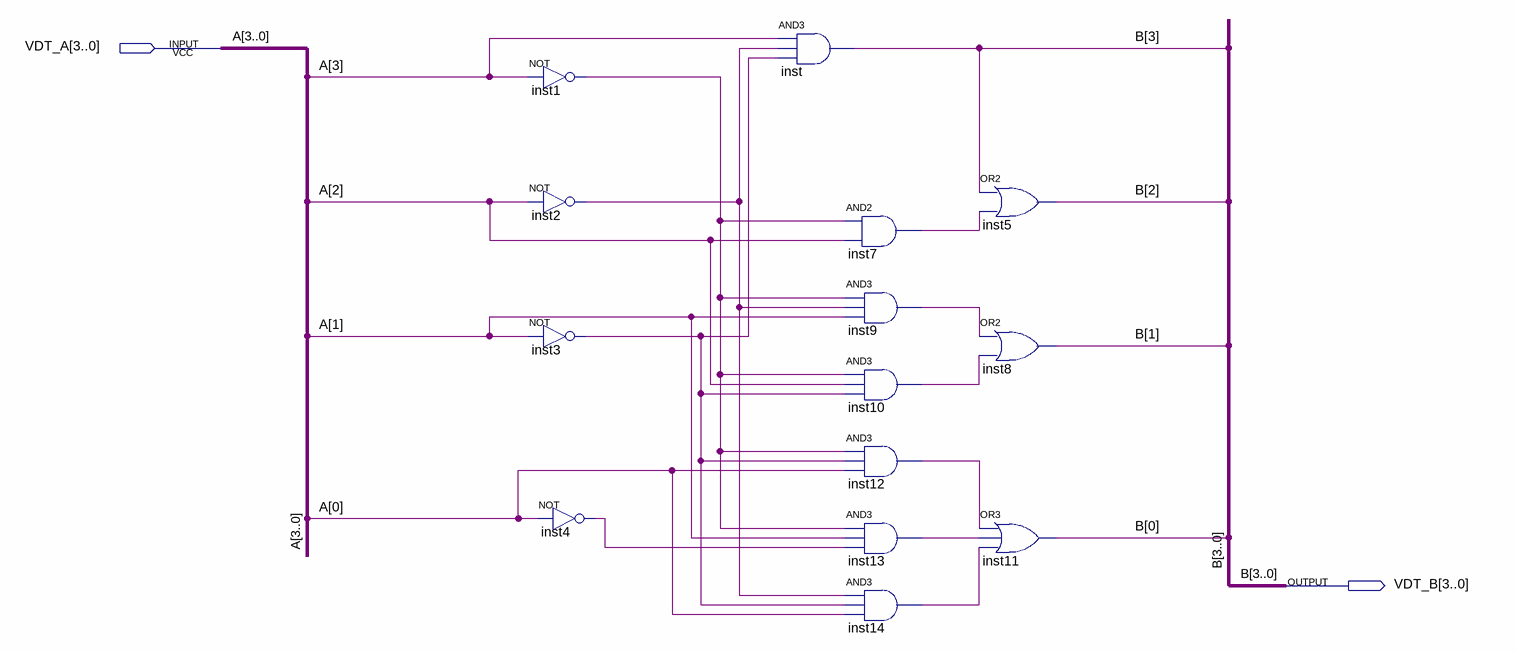
[diagram p0: schematic sheet]
// Quartus schematic Assignment3.bdf as structural Verilog: 14 symbols, 2 pins
module Assignment3 (
  input  [3:0] VDT_A,
  output [3:0] VDT_B
);

  wire inst1_out, inst2_out, inst3_out, inst4_out, inst7_out, inst9_out, inst10_out, inst12_out, inst13_out,
       inst14_out;

  not inst1 (inst1_out, VDT_A[3]);
  not inst2 (inst2_out, VDT_A[2]);
  not inst3 (inst3_out, VDT_A[1]);
  not inst4 (inst4_out, VDT_A[0]);
  and inst (VDT_B[3], VDT_A[3], inst2_out, inst3_out);
  and inst7 (inst7_out, inst1_out, VDT_A[2]);
  and inst9 (inst9_out, inst1_out, inst2_out, VDT_A[1]);
  and inst10 (inst10_out, inst1_out, VDT_A[2], inst3_out);
  and inst12 (inst12_out, inst1_out, inst3_out, VDT_A[0]);
  and inst13 (inst13_out, inst1_out, VDT_A[1], inst4_out);
  and inst14 (inst14_out, inst2_out, inst3_out, VDT_A[0]);
  or inst5 (VDT_B[2], VDT_B[3], inst7_out);
  or inst8 (VDT_B[1], inst9_out, inst10_out);
  or inst11 (VDT_B[0], inst12_out, inst13_out, inst14_out);

  // Other names for the same wires on the sheet: A[3:0] = VDT_A; B[3:0] = VDT_B
endmodule
